# EAGLE design main (EAGLE 8.6.1)
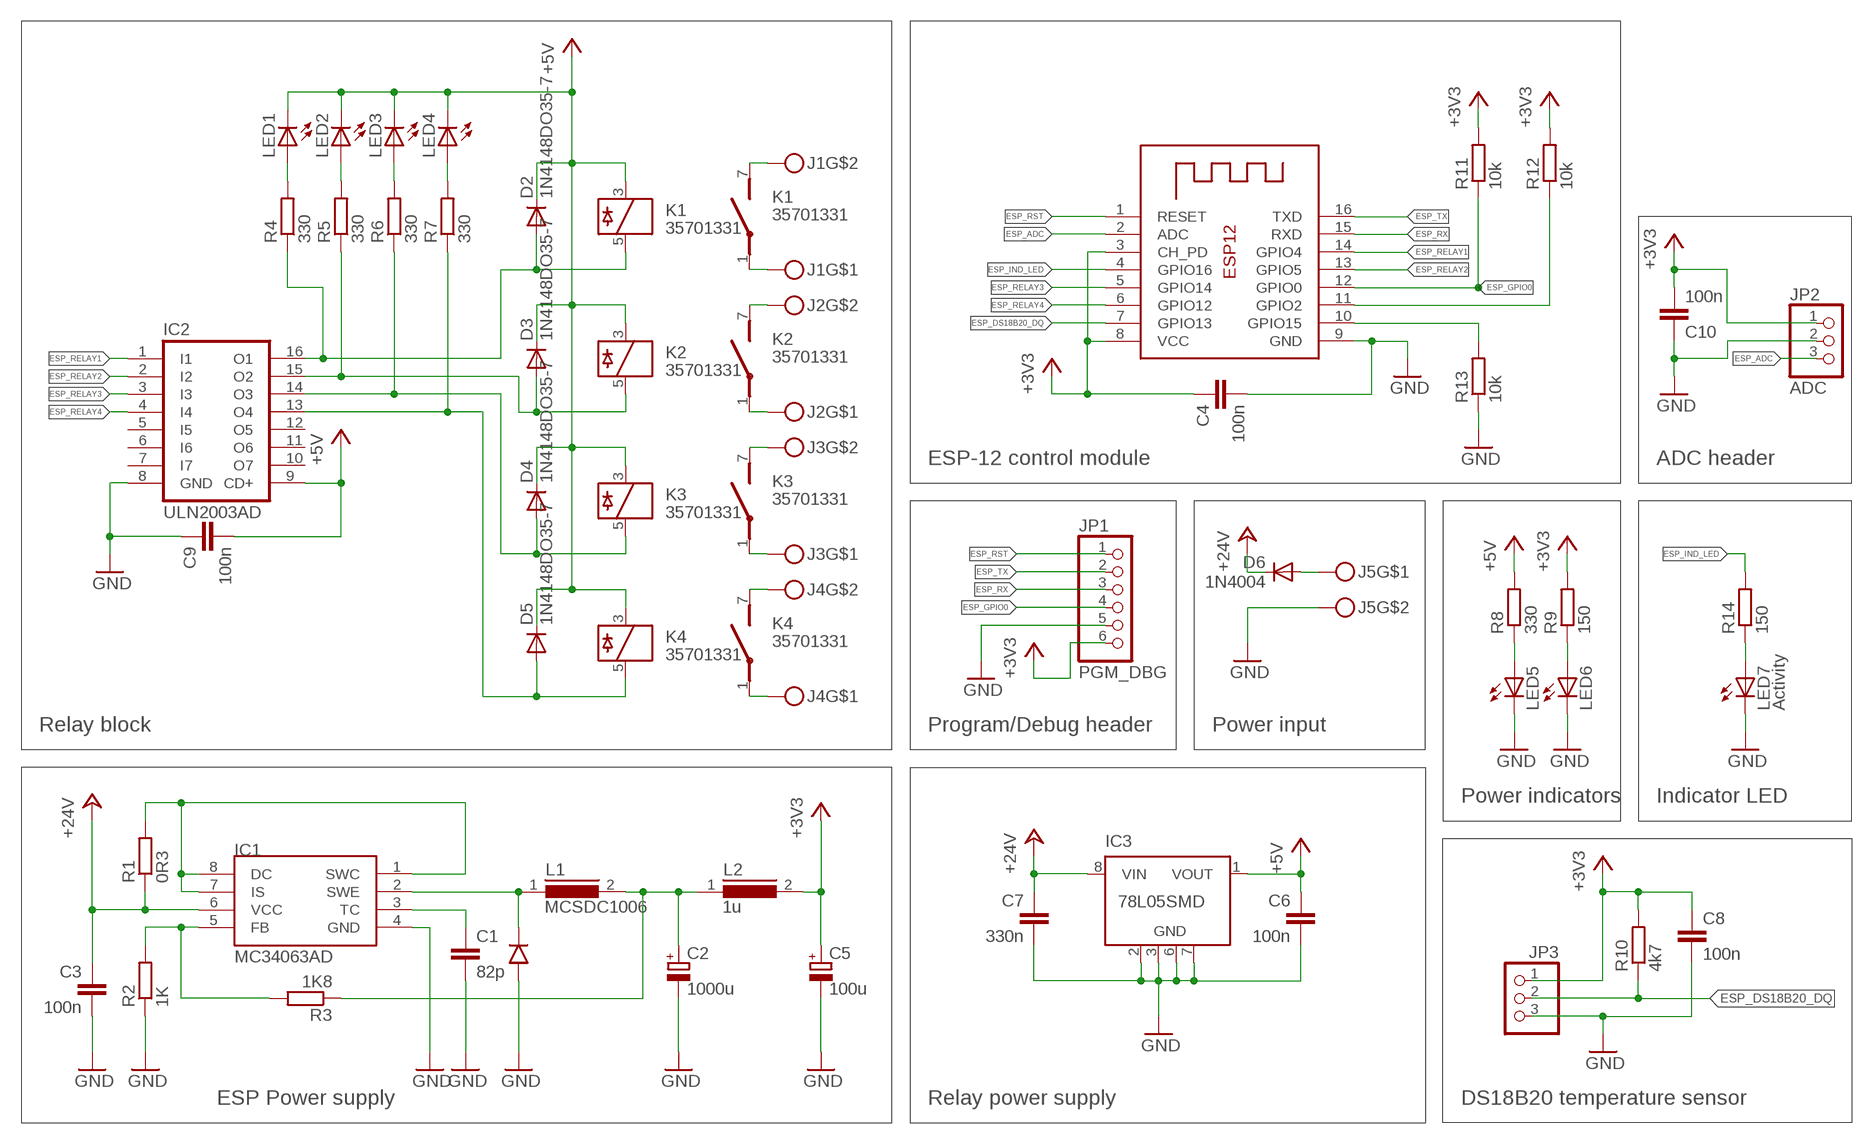
[diagram p0: schematic, sheet 1]

## Parts
C1  82p  C-EUC1206  [C1206]
C2  1000u  CPOL-EUUD-10X10  [UD-10X10_NICHICON]
C3  100n  C-EUC1206  [C1206]
C4  100n  C-EUC1206  [C1206]
C5  100u  CPOL-EU153CLV-0807  [153CLV-0807]
C6  100n  C-EUC1206  [C1206]
C7  330n  C-EUC1206  [C1206]
C8  100n  C-EUC1206  [C1206]
C9  100n  C-EUC1206  [C1206]
C10  100n  C-EUC1206  [C1206]
D1  1N5819HW  [SOD123]
D2  1N4148DO35-7  [DO35-7]
D3  1N4148DO35-7  [DO35-7]
D4  1N4148DO35-7  [DO35-7]
D5  1N4148DO35-7  [DO35-7]
D6  1N4004  [DO41-10]
IC1  MC34063AD  [SOIC8]
IC2  ULN2003AD  [SO16]
IC3  78L05SMD  [SO08]
J1  SCREW-TERMINAL-2PIN  [PITCH4.3-PIN2]
J2  SCREW-TERMINAL-2PIN  [PITCH4.3-PIN2]
J3  SCREW-TERMINAL-2PIN  [PITCH4.3-PIN2]
J4  SCREW-TERMINAL-2PIN  [PITCH4.3-PIN2]
J5  PWR_IN  SCREW-TERMINAL-2PIN  [PITCH4.3-PIN2]
JP1  PGM_DBG  PINHD-1X6  [1X06]
JP2  ADC  PINHD-1X3  [1X03]
JP3  PINHD-1X3  [1X03]
K1  35701331  [REED]
K2  35701331  [REED]
K3  35701331  [REED]
K4  35701331  [REED]
L1  MCSDC1006  [SMD]
L2  1u  SMD1210  [R1210]
LED1  LED5MM  [LED5MM]
LED2  LED5MM  [LED5MM]
LED3  LED5MM  [LED5MM]
LED4  LED5MM  [LED5MM]
LED5  LED5MM  [LED5MM]
LED6  LED5MM  [LED5MM]
LED7  Activity  LED5MM  [LED5MM]
R1  0R3  R-EU_R1206  [R1206]
R2  1K  R-EU_R1206  [R1206]
R3  1K8  R-EU_R1206  [R1206]
R4  330  R-EU_R1206  [R1206]
R5  330  R-EU_R1206  [R1206]
R6  330  R-EU_R1206  [R1206]
R7  330  R-EU_R1206  [R1206]
R8  330  R-EU_R1206  [R1206]
R9  150  R-EU_R1206  [R1206]
R10  4k7  R-EU_R1206  [R1206]
R11  10k  R-EU_R1206  [R1206]
R12  10k  R-EU_R1206  [R1206]
R13  10k  R-EU_R1206  [R1206]
R14  150  R-EU_R1206  [R1206]
X1  ESP-12  [ESP-12]

## Nets
+3V3: C4.1 C5.+ C8.1 C10.2 JP1.6 JP2.1 JP3.1 L2.2 R9.2 R10.2 R11.2 R12.2 X1.3(CH_PD) X1.8(VCC)
+5V: C6.1 C9.2 D2.C D3.C D4.C D5.C IC2.9(CD+) IC3.1(VOUT) K1.3 K2.3 K3.3 K4.3 LED1.K(C) LED2.K(C) LED3.K(C) LED4.K(C) R8.2
+24V: C3.1 C7.1 D6.C IC1.6(VCC) IC3.8(VIN) R1.1
ESP_ADC: JP2.3 X1.2(ADC)
ESP_DS18B20_DQ: JP3.2 R10.1 X1.7(GPIO13)
ESP_GPIO0: JP1.4 R11.1 X1.12(GPIO0)
ESP_IND_LED: R14.2 X1.4(GPIO16)
ESP_RELAY1: IC2.1(I1) X1.14(GPIO4)
ESP_RELAY2: IC2.2(I2) X1.13(GPIO5)
ESP_RELAY3: IC2.3(I3) X1.5(GPIO14)
ESP_RELAY4: IC2.4(I4) X1.6(GPIO12)
ESP_RST: JP1.1 X1.1(RESET)
ESP_RX: JP1.3 X1.15(RXD)
ESP_TX: JP1.2 X1.16(TXD)
GND: C1.2 C2.- C3.2 C4.2 C5.- C6.2 C7.2 C8.2 C9.1 C10.1 D1.A IC1.4(GND) IC2.8(GND) IC3.2(GND) IC3.3(GND) IC3.6(GND) IC3.7(GND) J5.2 JP1.5 JP2.2 JP3.3 LED5.K(C) LED6.K(C) LED7.K(C) R2.1 R13.1 X1.9(GND)
N$1: IC1.1(SWC) IC1.7(IS) IC1.8(DC) R1.2
N$2: C1.1 IC1.3(TC)
N$3: J1.2 K1.7(2:S)
N$4: D1.C IC1.2(SWE) L1.1
N$5: IC1.5(FB) R2.2 R3.2
N$6: J1.1 K1.1(2:P)
N$7: J2.2 K2.7(2:S)
N$8: J2.1 K2.1(2:P)
N$9: D2.A IC2.16(O1) K1.5 R4.1
N$10: D3.A IC2.15(O2) K2.5 R5.1
N$11: J3.2 K3.7(2:S)
N$12: D5.A IC2.13(O4) K4.5 R7.1
N$13: J3.1 K3.1(2:P)
N$14: D6.A J5.1
N$15: J4.2 K4.7(2:S)
N$16: J4.1 K4.1(2:P)
N$17: C2.+ L1.2 L2.1 R3.1
N$18: LED1.A R4.2
N$19: D4.A IC2.14(O3) K3.5 R6.1
N$20: LED2.A R5.2
N$21: LED3.A R6.2
N$22: LED4.A R7.2
N$23: LED5.A R8.1
N$24: LED6.A R9.1
N$25: R12.1 X1.11(GPIO2)
N$26: R13.2 X1.10(GPIO15)
N$27: LED7.A R14.1
Unconnected: IC2.5(I5) IC2.6(I6) IC2.7(I7) IC2.10(O7) IC2.11(O6) IC2.12(O5) IC3.4(NC) IC3.5(NC)

## Notes on the sheet
- ESP-12 control module | ADC header
- Relay block | Program/Debug header | Power input
- Power indicators | Indicator LED
- ESP Power supply | Relay power supply | DS18B20 temperature sensor

## Library data of the parts
C1 C3 C4 C6-C10 = rcl:C-EU: CAPACITOR, European symbol; SPICEPREFIX: C
C2 C5 = rcl:CPOL-EU: POLARIZED CAPACITOR, European symbol; SPICEPREFIX: C
D1 = bytewerk-diode:1N5819HW: Si-Diode - Icont=1A; MF: DIODES INC.; MPN: 1N5819HW-7-F; OC_FARNELL: 1773475
D2-D5 = diode:1N4148: DIODE high speed (Philips)
D6 = adafruit:1N4004: DIODE General purpose 1N400x type rectifier (With bigger pads) http://www.ladyada.net/library/pcb/eaglelibrary.html
IC1 = mc34063:MC34063
IC2 = uln-udn:ULN2003A: DRIVER ARRAY
IC3 = linear:78L*SMD: Positive VOLTAGE REGULATOR
J1-J5 = screw-terminal:SCREW-TERMINAL-2PIN
JP1 = pinhead:PINHD-1X6: PIN HEADER
JP2 JP3 = pinhead:PINHD-1X3: PIN HEADER
K1-K4 = relay:35701331: RELAY reed, 1 x norm. open with polarity; OC_FARNELL: unknown; OC_NEWARK: unknown
L1 = inductor-multicomp:MCSDC1006
L2 = inductor:SMD1210: SMD 1210 inductor
LED1-LED7 = led:LED: LED OSRAM: - CHIPLED LG R971, LG N971, LY N971, LG Q971, LY Q971, LO R971, LY R971 LH N974, LH R974 LS Q976, LO Q976, LY Q976 LO Q996 - Hyper CHIPLED LW Q18S LB Q993, LB Q99A, LB R99A - SideLED LS A670, LO A670, LY A670, LG A670, LP A670 LB A673, LV A673, LT A673, LW A673 LH A674 LY A675 LS A676, LA A676, LO A676, LY A676, LW A676 LS A679, LY A679, LG A679 - Hyper Micro SIDELED® LS Y876, LA Y876, LO Y876, LY Y876 LT Y87S - SmartLED LW L88C, LW L88S LB L89C, LB L89S, LG L890 LS L89K, LO L89K, LY L89K LS L896, LA L896, LO L896, LY L896 - TOPLED LS T670, LO T670, LY T670, LG T670, LP T670 LSG T670, LSP T670, LSY T670, LOP T670, LYG T670 LG T671, LOG T671, LSG T671 LB T673, LV T673, LT T673, LW T673 LH T674 LS T676, LA T676, LO T676, LY T676, LB T676, LH T676, LSB T676, LW T676 LB T67C, LV T67C, LT T67C, LS T67K, LO T67K, LY T67K, LW E67C LS E67B, LA E67B, LO E67B, LY E67B, LB E67C, LV E67C, LT E67C LW T67C LS T679, LY T679, LG T679 LS T770, LO T770, LY T770, LG T770, LP T770 LB T773, LV T773, LT T773, LW T773 LH T774 LS E675, LA E675, LY E675, LS T675 LS T776, LA T776, LO T776, LY T776, LB T776 LHGB T686 LT T68C, LB T68C - Hyper Mini TOPLED® LB M676 - Mini TOPLED Santana® LG M470 LS M47K, LO M47K, LY M47K Source: http://www.osram.convergy.de LUXEON: - LUMILED® LXK2-PW12-R00, LXK2-PW12-S00, LXK2-PW14-U00, LXK2-PW14-V00 LXK2-PM12-R00, LXK2-PM12-S00, LXK2-PM14-U00 LXK2-PE12-Q00, LXK2-PE12-R00, LXK2-PE12-S00, LXK2-PE14-T00, LXK2-PE14-U00 LXK2-PB12-K00, LXK2-PB12-L00, LXK2-PB12-M00, LXK2-PB14-N00, LXK2-PB14-P00, LXK2-PB14-Q00 LXK2-PR12-L00, LXK2-PR12-M00, LXK2-PR14-Q00, LXK2-PR14-R00 LXK2-PD12-Q00, LXK2-PD12-R00, LXK2-PD12-S00 LXK2-PH12-R00, LXK2-PH12-S00 LXK2-PL12-P00, LXK2-PL12-Q00, LXK2-PL12-R00 Source: www.luxeon.com KINGBRIGHT: KA-3528ASYC Source: www.kingbright.com
R1-R14 = rcl:R-EU_: RESISTOR, European symbol; SPICEPREFIX: R
X1 = adafruit:ESP-12

## Board
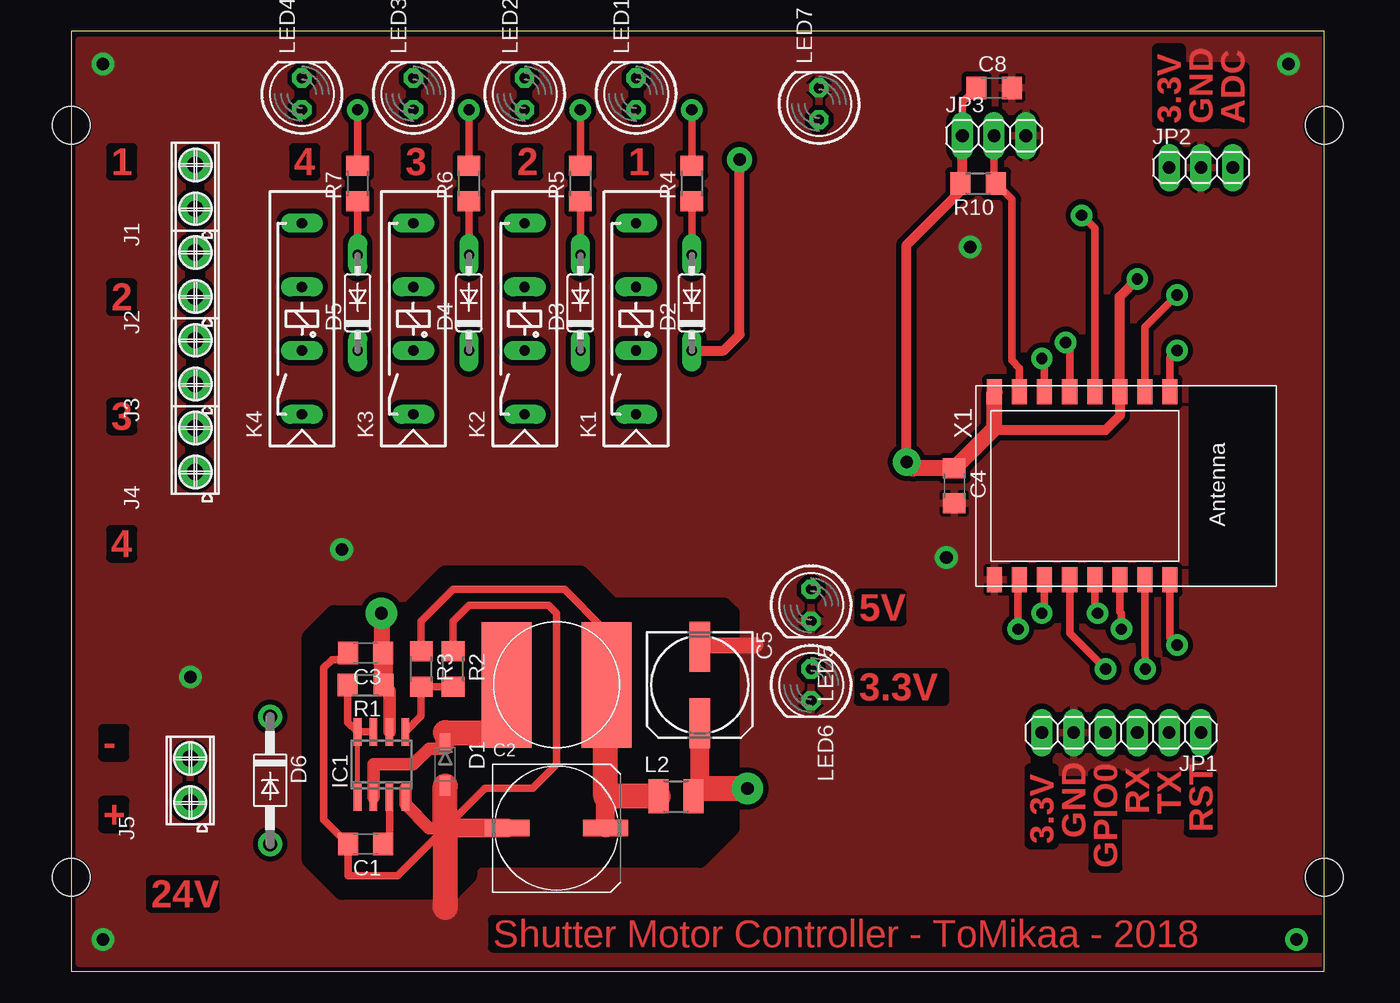
[diagram p1: board, top side]
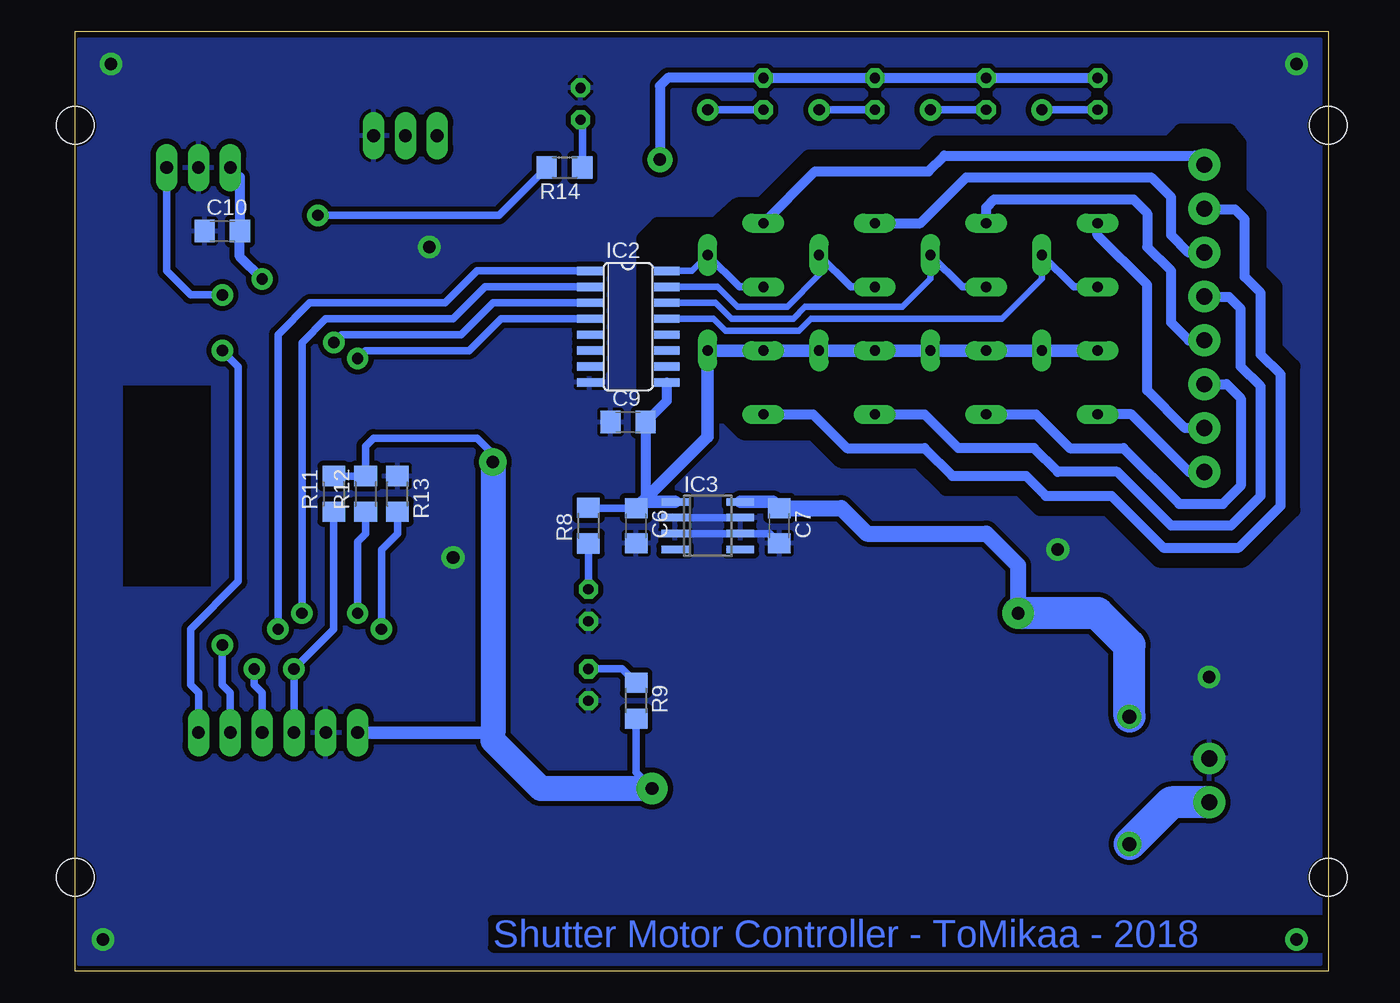
[diagram p2: board, bottom side, seen from below]

Size 100 x 75 mm. Coordinates in mm from the lower left corner, seen from the top.
Outline: 0,0 100,0 100,75 0,75 0,0
Copper layers (1*16): Top 0.035mm / dielectric 1.5mm / Bottom 0.035mm
Design rules "default *": minimum track width 12mil, minimum drill 0.65mm, track to track 16mil, track to pad 16mil, pad to pad 16mil, via to via 16mil, smd to smd 16mil, copper to edge 6mil, drill to drill 6mil, minimum pad ring 14mil, minimum via ring 16mil, stop-mask expansion 4mil, vias tented up to drill 0mil, thermal gap 10mil
Holes 3 mm at 0,7.5 100,7.5 100,67.5 0,67.5
tRestrict: area 19.1,6.3 to 52.7,31.8
bRestrict: area 2.9,32.9 to 54.6,67

### Footprints (pad centres in the part's own frame; a part is rotated, then mirrored left to right if it is on the bottom)
C1206 = smd 1.6 x 1.8: 1 -1.4,0; 2 1.4,0
UD-10X10_NICHICON = smd 3.6 x 1.3: + 3.925,0; - -3.95,0
153CLV-0807 = smd 4 x 1.6: + 3.05,0; - -3.05,0
SOD123 = smd 1.6 x 0.8: A 1.7,0; C -1.7,0
DO35-7 = drill 0.813 long: A 3.81,0; C -3.81,0
DO41-10 = drill 1.118 pad 1.93: A 5.08,0; C -5.08,0
SOIC8 = smd 0.6 x 2.2: 1 -1.905,-2.6; 2 -0.635,-2.6; 3 0.635,-2.6; 4 1.905,-2.6; 5 1.905,2.6; 6 0.635,2.6; 7 -0.635,2.6; 8 -1.905,2.6
SO16 = smd 0.66 x 2.032: 1 -4.445,-3.073; 2 -3.175,-3.073; 3 -1.905,-3.073; 4 -0.635,-3.073; 5 0.635,-3.073; 6 1.905,-3.073; 7 3.175,-3.073; 8 4.445,-3.073; 9 4.445,3.073; 10 3.175,3.073; 11 1.905,3.073; 12 0.635,3.073; 13 -0.635,3.073; 14 -1.905,3.073; 15 -3.175,3.073; 16 -4.445,3.073
SO08 = smd 0.6 x 2.2: 1 -1.905,-2.6; 2 -0.635,-2.6; 3 0.635,-2.6; 4 1.905,-2.6; 5 1.905,2.6; 6 0.635,2.6; 7 -0.635,2.6; 8 -1.905,2.6
PITCH4.3-PIN2 = drill 1.3 pad 2.54: 1 -1.75,0.025; 2 1.75,0.025
1X06 = drill 1.016 long: 1 -6.35,0; 2 -3.81,0; 3 -1.27,0; 4 1.27,0; 5 3.81,0; 6 6.35,0
1X03 = drill 1.016 long: 1 -2.54,0; 2 0,0; 3 2.54,0
REED = drill 0.813 long: 1 -17.78,2.54; 3 -12.7,2.54; 5 -7.62,2.54; 7 -2.54,2.54
SMD = smd 4 x 10: 1 -4,0; 2 4,0
R1210 = smd 1.6 x 2.7: 1 -1.4,0; 2 1.4,0
LED5MM = drill 0.813 octagon: A -1.27,0; K 1.27,0
R1206 = smd 1.6 x 1.803: 1 -1.422,0; 2 1.422,0
ESP-12 = smd 2 x 1.2: 1 -7.5,4.5; 2 -7.5,2.5; 3 -7.5,0.5; 4 -7.5,-1.5; 5 -7.5,-3.5; 6 -7.5,-5.5; 7 -7.5,-7.5; 8 -7.5,-9.5; 9 7.5,-9.5; 10 7.5,-7.5; 11 7.5,-5.5; 12 7.5,-3.5; 13 7.5,-1.5; 14 7.5,0.5; 15 7.5,2.5; 16 7.5,4.5

### Placement (x,y rotation side)
C1  23.5,10.16 180 top
C2  38.73,11.43 0 top
C3  23.5,25.4 180 top
C4  70.48,38.73 270 top
C5  50.16,22.86 270 top
C6  55.24,35.56 270 bottom
C7  43.81,35.56 270 bottom
C8  73.66,70.48 0 top
C9  55.88,43.81 0 bottom
C10  88.27,59.05 0 bottom
D1  29.84,16.51 270 top
D2  49.53,53.34 90 top
D3  40.64,53.34 90 top
D4  31.75,53.34 90 top
D5  22.86,53.34 90 top
D6  15.88,15.24 270 top
IC1  24.77,16.51 0 top
IC2  55.88,51.44 270 bottom
IC3  49.53,35.56 270 bottom
J1  9.93,62.6 90 top
J2  9.93,55.6 90 top
J3  9.93,48.6 90 top
J4  9.93,41.6 90 top
J5  9.53,15.24 90 top
JP1  83.82,19.05 180 top
JP2  90.17,64.14 0 top
JP3  73.66,66.67 0 top
K1  47.62,62.23 90 top
K2  38.73,62.23 90 top
K3  29.84,62.23 90 top
K4  20.95,62.23 90 top
L1  38.73,22.86 0 top
L2  48.26,13.97 0 top
LED1  45.09,70.01 90 top
LED2  36.2,70.01 90 top
LED3  27.3,70.01 90 top
LED4  18.41,70.01 90 top
LED5  59.05,29.21 270 top
LED6  59.05,22.86 270 top
LED7  59.69,69.22 90 top
R1  23.5,22.86 180 top
R2  30.48,24.13 270 top
R3  27.94,24.13 270 top
R4  49.53,62.87 90 top
R5  40.64,62.87 90 top
R6  31.75,62.87 90 top
R7  22.86,62.87 90 top
R8  59.05,35.56 90 bottom
R9  55.24,21.59 270 bottom
R10  72.39,62.87 180 top
R11  79.38,38.1 90 bottom
R12  76.83,38.1 90 bottom
R13  74.3,38.1 270 bottom
R14  60.96,64.14 180 bottom
X1  83.19,38.73 270 top

### Tracks (layer width: path | path; a pad name or v marks a point on that pad's centre or on a via)
+3V3  (via drill 0.9 pad 1.6, 1 pad 2.2, 1 pad 2.5)
  Top 0.61: 73.66,43.18 73.59,43.24 | C8.1 71.12,69.34 JP3.1
  Top 0.813: 73.59,43.24 73.69,43.34 | 73.66,43.18 82.55,43.18 83.69,44.31 X1.3 83.69,53.84 v85.09,55.24 | v66.67,40.64 66.67,57.94 70.97,62.23 R10.2 71.12,63.02 JP3.1
  Top 1.27: 73.59,43.24 C4.1 67.18,40.13 v66.67,40.64 | 73.69,43.34 X1.8 | 50.16,14.47 L2.2 50.3,14.61
  Top 1.524: 50.16,14.47 C5.+
  Top 2: 50.3,14.61 v53.98,14.61
  Bottom 0.61: R9.2 55.24,15.88 v53.98,14.61 | R11.2 R12.2 76.83,41.91 76.2,42.55 67.94,42.55 66.67,41.27 v66.67,40.64
  Bottom 0.813: JP2.1 86.86,63.37 C10.2 86.86,57.02 v85.09,55.24
  Bottom 1.016: JP1.6 66.67,19.05
  Bottom 1.27: 66.67,19.05 66.67,18.41
  Bottom 2: 66.67,18.41 62.87,14.61 v53.98,14.61 | v66.67,40.64 66.67,19.05
+5V  (via drill 1 pad 2)
  Top 0.813: D2.C 52.07,49.53 53.34,50.8 v53.34,64.77
  Bottom 0.61: 54.74,37.47 C6.1 59.03,36.96 R8.2
  Bottom 0.813: LED4.K LED3.K LED2.K LED1.K 52.7,71.28 53.34,70.64 v53.34,64.77 | 54.74,37.47 54.48,37.73 C9.2 52.81,45.49 IC2.9
  Bottom 1.016: K4.3 D5.C K3.3 D4.C K2.3 D3.C K1.3 D2.C 49.53,42.67 54.48,37.73 | IC3.1 54.74,37.47
+24V  (via drill 1 pad 2.5)
  Top 0.813: 25.4,22.38 R1.1
  Top 1.016: IC1.6 25.4,22.38
  Top 1.27: 24.89,22.88 R1.1 | v24.77,28.57 24.77,25.53 C3.1
  Top 1.524: C3.1 24.89,22.88
  Bottom 0.61: 44.32,37.47 C7.1
  Bottom 1.016: IC3.8 44.32,37.47
  Bottom 1.27: C7.1 38.87,36.96 36.83,34.92 27.3,34.92 24.77,32.38 v24.77,28.57
  Bottom 2.54: D6.C 15.88,26.04 18.41,28.57 v24.77,28.57
ESP_ADC  (via drill 0.9 pad 1.6)
  Top 0.61: X1.2 85.69,51.4 v88.27,53.98
  Bottom 0.61: v88.27,53.98 90.81,53.98 92.71,55.88 JP2.3
ESP_DS18B20_DQ
  Top 0.61: X1.7 75.69,48.14 75.08,48.74 75.08,61.59 R10.1 73.66,63.02 JP3.2
ESP_GPIO0  (via drill 0.9 pad 1.6)
  Top 0.61: X1.12 79.69,27 v82.55,24.13
  Bottom 0.61: v82.55,24.13 JP1.4 | 80.64,26.04 v82.55,24.13 | R11.1 79.38,27.3 v82.55,24.13
ESP_IND_LED  (via drill 0.9 pad 1.6)
  Top 0.61: X1.4 81.69,59.28 v80.64,60.33
  Bottom 0.61: v80.64,60.33 66.19,60.33 R14.2
ESP_RELAY1  (via drill 0.9 pad 1.6)
  Top 0.61: X1.14 83.69,28.71 83.82,28.57 v83.82,27.3
  Bottom 0.61: v83.82,27.3 83.82,50.8 81.28,53.34 70.48,53.34 67.94,55.88 IC2.1
ESP_RELAY2  (via drill 0.9 pad 1.6)
  Top 0.61: X1.13 81.69,28.8 v81.92,28.57
  Bottom 0.61: v81.92,28.57 81.92,50.16 80.01,52.07 69.85,52.07 67.31,54.61 IC2.2
ESP_RELAY3  (via drill 0.9 pad 1.6)
  Top 0.61: v79.38,50.16 79.69,49.85 X1.5
  Bottom 0.61: IC2.3 66.67,53.34 69.22,50.8 78.74,50.8 v79.38,50.16
ESP_RELAY4  (via drill 0.9 pad 1.6)
  Top 0.61: X1.6 77.69,48.68 v77.47,48.9
  Bottom 0.61: IC2.4 66.04,52.07 68.58,49.53 76.83,49.53 v77.47,48.9
ESP_RST  (via drill 0.9 pad 1.6)
  Top 0.61: X1.1 87.69,48.95 v88.27,49.53
  Bottom 0.61: JP1.1 90.17,22.23 90.81,22.86 90.81,27.3 87,31.11 87,48.26 v88.27,49.53
ESP_RX  (via drill 0.9 pad 1.6)
  Top 0.61: X1.15 85.69,26.07 v85.72,24.13
  Bottom 0.61: v85.72,24.13 85.72,22.86 85.09,22.23 JP1.3
ESP_TX  (via drill 0.9 pad 1.6)
  Top 0.61: X1.16 87.69,26.61 v88.27,26.04
  Bottom 0.61: v88.27,26.04 88.27,22.86 87.63,22.23 JP1.2
GND  (via drill 1)
  Top 0.61: C3.2 21.57,24.88 20.81,24.88 20.16,24.22 20.16,12.1 C1.2 22.09,7.62 26.04,7.62 29.84,11.43 33.02,14.61 36.83,14.61 38.73,16.51 38.73,28.57 38.1,29.21 31.75,29.21 30.48,27.94 R2.1
  Top 1.016: 29.84,11.43 28.57,11.43 26.67,13.34 IC1.4 26.67,14.61
  Top 1.27: C5.- 50.29,26.04 54.61,26.04
  Top 1.524: C2.- 29.84,11.43
  Top 2: D1.A 29.84,11.43 29.84,5.08
  Bottom 0.61: IC3.7 IC3.2 | IC3.3 IC3.6 44.58,34.92 C7.2
  other vias: 2.54,72.39 97.16,72.39 2.54,2.54 97.79,2.54 9.53,23.5 21.59,33.66 71.75,57.78 69.85,33.02
  pour Bottom: 0.64,0.64 0.64,74.3 99.69,74.3 99.69,0.64
  pour Top: 0.64,0.64 99.69,0.64 99.69,74.3 0.64,74.3
N$1
  Top 0.406: IC1.1 IC1.8
  Top 0.61: IC1.7 IC1.8 22.07,19.9 R1.2
N$2
  Top 0.61: IC1.3 25.4,10.66 C1.1
N$3
  Bottom 0.813: K1.7 40.96,63.82 31.91,63.82 30.64,65.09 10.64,65.09 J1.2
N$4
  Top 0.813: 29.84,17.78 D1.C
  Top 1.016: IC1.2 24.13,16.51 27.3,16.51 28.57,17.78 29.84,17.78
  Top 1.27: 34.29,19.05 34.92,19.68 34.73,19.88 L1.1
  Top 1.524: D1.C 29.84,19.05
  Top 2: 29.84,19.05 34.29,19.05
N$5
  Top 0.61: R2.2 R3.2 27.94,20.38 IC1.5
N$6
  Bottom 0.813: J1.1 9.85,60.8 7.46,60.8 6.67,60.01 6.67,55.4 5.4,54.13 5.4,49.21 3.81,47.62 3.81,37.15 7.14,33.81 13.18,33.81 17.3,37.94 22.54,37.94 24.13,39.53 30,39.53 32.23,41.75 38.42,41.75 41.12,44.45 K1.1
N$7
  Bottom 0.813: J2.2 11.15,57.35 12.54,58.74 12.54,61.75 14.13,63.34 28.89,63.34 32.54,59.69 K2.7
N$8
  Bottom 0.813: J2.1 9.87,53.82 7.94,53.82 6.99,52.86 6.99,48.26 5.4,46.67 5.4,37.94 7.78,35.56 12.54,35.56 16.83,39.85 21.59,39.85 23.5,41.75 29.53,41.75 32.23,44.45 K2.1
N$9
  Top 0.61: R4.1 D2.A
  Bottom 0.508: IC2.16 50.8,55.88 D2.A
  Bottom 0.61: D2.A 46.99,54.61 K1.5
N$10
  Top 0.61: R5.1 D3.A
  Bottom 0.508: IC2.15 48.74,54.61 47.15,53.02 43.18,53.02 40.64,55.56 D3.A
  Bottom 0.61: D3.A 38.1,54.61 K2.5
N$11
  Bottom 0.813: K3.7 27.3,60.96 26.67,61.59 15.56,61.59 14.45,60.48 14.45,57.78 12.54,55.88 12.54,51.75 11.14,50.35 J3.2
N$12
  Top 0.61: R7.1 D5.A
  Bottom 0.508: IC2.13 49.05,52.07 48.1,51.12 42.23,51.12 41.27,52.07 26.04,52.07 22.86,55.24 D5.A
  Bottom 0.61: D5.A 20.32,54.61 K4.5
N$13
  Bottom 0.813: J3.1 8.12,46.85 6.99,45.72 6.99,38.73 8.41,37.31 11.91,37.31 16.35,41.75 20.64,41.75 23.34,44.45 K3.1
N$14
  Bottom 2.54: J5.1 12.54,13.49 D6.A
N$15
  Bottom 0.813: J4.2 11.44,43.35 14.45,46.35 14.45,54.77 18.41,58.74 K4.7
N$16
  Bottom 0.813: J4.1 11.12,39.85 15.72,44.45 K4.1
N$17
  Top 0.61: L1.2 42.55,23.05 42.55,27.3 39.37,30.48 30.48,30.48 27.94,27.94 R3.1
  Top 1.27: 42.66,22.79 L1.2
  Top 1.524: C2.+ 42.66,13.97
  Top 2: 42.66,22.79 42.66,13.97 L2.1
N$18  (via drill 0.9 pad 1.6)
  Top 0.61: R4.2 v49.53,68.74
  Bottom 0.61: v49.53,68.74 LED1.A
N$19
  Top 0.61: R6.1 D4.A
  Bottom 0.508: IC2.14 48.9,53.34 47.62,52.07 42.7,52.07 41.75,53.02 33.97,53.02 31.75,55.24 D4.A
  Bottom 0.61: D4.A 29.21,54.61 K3.5
N$20  (via drill 0.9 pad 1.6)
  Top 0.61: R5.2 v40.64,68.74
  Bottom 0.61: v40.64,68.74 LED2.A
N$21  (via drill 0.9 pad 1.6)
  Top 0.61: R6.2 v31.75,68.74
  Bottom 0.61: v31.75,68.74 LED3.A
N$22  (via drill 0.9 pad 1.6)
  Top 0.61: R7.2 v22.86,68.74
  Bottom 0.61: v22.86,68.74 LED4.A
N$23
  Bottom 0.61: R8.1 LED5.A
N$24
  Bottom 0.61: R9.1 56.36,24.13 LED6.A
N$25  (via drill 0.9 pad 1.6)
  Top 0.61: X1.11 77.69,28.79 v77.47,28.57
  Bottom 0.61: v77.47,28.57 77.47,34.29 76.83,34.92 R12.1
N$26  (via drill 0.9 pad 1.6)
  Top 0.61: X1.10 75.56,31.11 v75.56,27.3
  Bottom 0.61: v75.56,27.3 75.56,33.66 74.3,34.92 R13.2
N$27
  Bottom 0.61: LED7.A 59.54,67.79 R14.1

### Text on the board
Top: 3.3V | GND | ADC | 1 | 4 | 3 | 2 | 1 | 2 | 3 | 4 | 5V | 3.3V | - | RX | TX | + | GND | RST | 3.3V | GPIO0 | 24V | Shutter Motor Controller - ToMikaa - 2018
Bottom: Shutter Motor Controller - ToMikaa - 2018